# Altium project HighBoard.PrjPcb
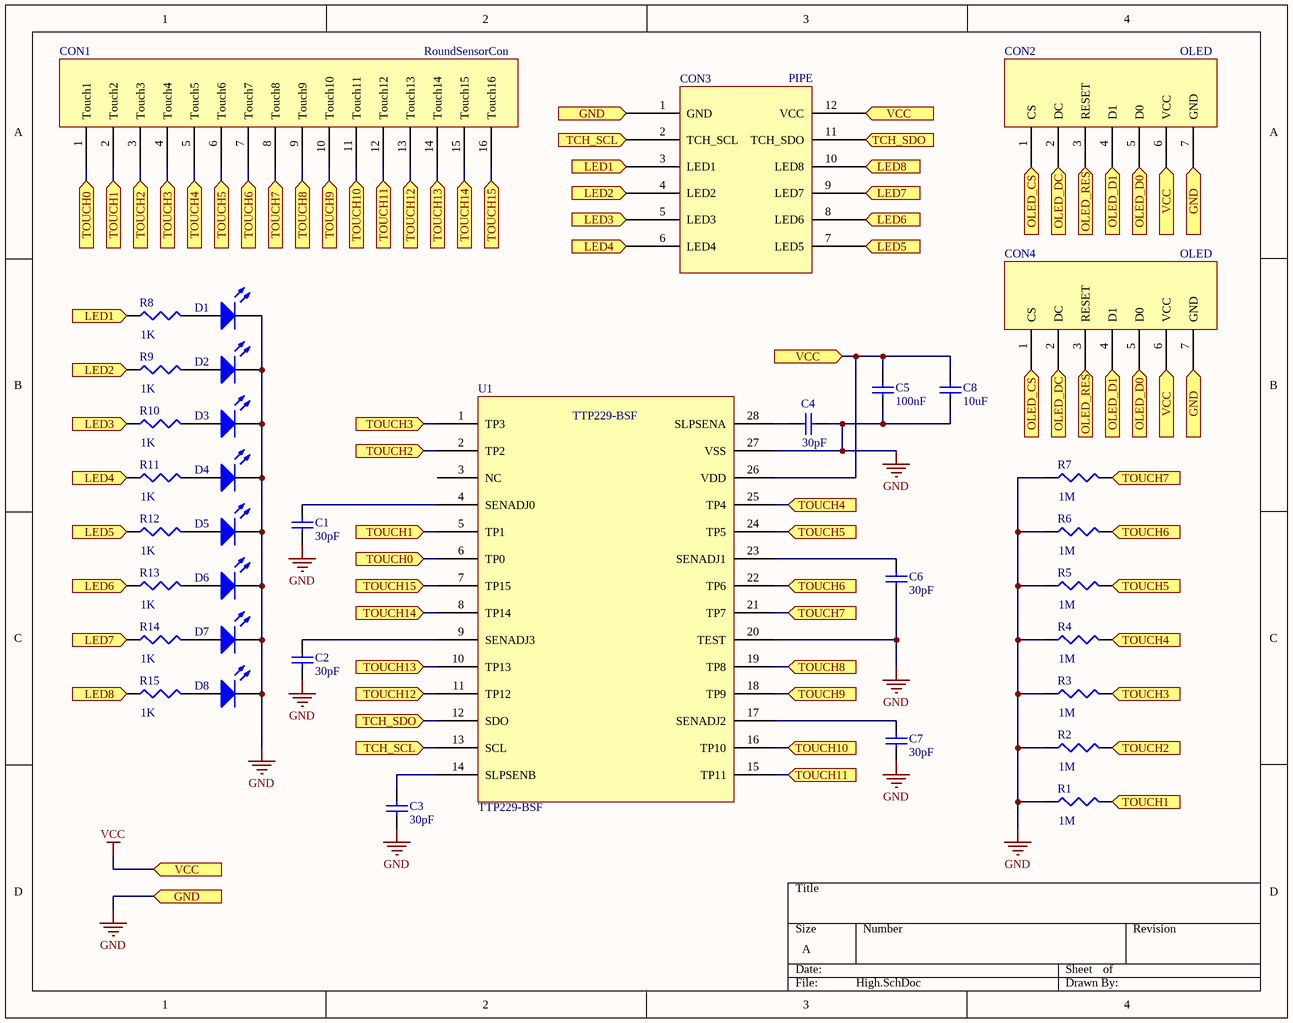
[diagram p0: High.SchDoc]
1 sheet, 36 parts. Net scope: flat (ports and power ports of the same name join across sheets).
Board file: High_v4.PcbDoc

## Sheet High.SchDoc
size A; PageSetup: Record=PageOptions|CenterHorizontal=True|CenterVertical=True|PrintScale=1.00|XCorrection=1.00|YCorrection=1.00|PrintKind=1|BorderSize=5000000|LeftOffset=0|BottomOffset=0|Orientation=2|PaperLength=1000|PaperWidth=1000|Scale=100|PaperSource=7|PrintQuality=-3|MediaType=1|DitherType=10|PrintScaleMode=1|PaperKind=A3|PaperIndex=8

### Parts
C1  value 30pF  [1608[0603]]  (hidden comment: Cap Semi)
C2  value 30pF  [1608[0603]]  (hidden comment: Cap Semi)
C3  value 30pF  [1608[0603]]  (hidden comment: Cap Semi)
C4  value 30pF  [1608[0603]]  (hidden comment: Cap Semi)
C5  value 100nF  [1608[0603]]  (hidden comment: Cap Semi)
C6  value 30pF  [1608[0603]]  (hidden comment: Cap Semi)
C7  value 30pF  [1608[0603]]  (hidden comment: Cap Semi)
C8  value 10uF  [1608[0603]]  (hidden comment: Cap Semi)
CON1  RoundSensorCon  [RoundSensorCon]
CON2  OLED  [OLED]
CON3  PIPE  [PIPE_SMALL]
CON4  OLED  [OLED_SNMALL]
D1  LED2  [LED0603]  (value not drawn)
D2  LED2  [LED0603]  (value not drawn)
D3  LED2  [LED0603]  (value not drawn)
D4  LED2  [LED0603]  (value not drawn)
D5  LED2  [LED0603]  (value not drawn)
D6  LED2  [LED0603]  (value not drawn)
D7  LED2  [LED0603]  (value not drawn)
D8  LED2  [LED0603]  (value not drawn)
R1  value 1M  [J1-0603]  (hidden comment: Res3)
R2  value 1M  [J1-0603]  (hidden comment: Res3)
R3  value 1M  [J1-0603]  (hidden comment: Res3)
R4  value 1M  [J1-0603]  (hidden comment: Res3)
R5  value 1M  [J1-0603]  (hidden comment: Res3)
R6  value 1M  [J1-0603]  (hidden comment: Res3)
R7  value 1M  [J1-0603]  (hidden comment: Res3)
R8  value 1K  [J1-0603]  (hidden comment: Res3)
R9  value 1K  [J1-0603]  (hidden comment: Res3)
R10  value 1K  [J1-0603]  (hidden comment: Res3)
R11  value 1K  [J1-0603]  (hidden comment: Res3)
R12  value 1K  [J1-0603]  (hidden comment: Res3)
R13  value 1K  [J1-0603]  (hidden comment: Res3)
R14  value 1K  [J1-0603]  (hidden comment: Res3)
R15  value 1K  [J1-0603]  (hidden comment: Res3)
U1  TTP229-BSF  [SSOP-28]

### Ports
GND, LED1, LED2, LED3, LED4, LED5, LED6, LED7, LED8, OLED_CS, OLED_D0, OLED_D1, OLED_DC, OLED_RES, TCH_SCL, TCH_SDO, TOUCH0, TOUCH1, TOUCH2, TOUCH3, TOUCH4, TOUCH5, TOUCH6, TOUCH7, TOUCH8, TOUCH9, TOUCH10, TOUCH11, TOUCH12, TOUCH13, TOUCH14, TOUCH15, VCC

### Nets
GND: C1.1 C2.1 C3.1 C4.2 C5.1 C6.1 C7.1 C8.1 CON2.7(GND) CON3.1(GND) CON4.7(GND) D1.2(K) D2.2(K) D3.2(K) D4.2(K) D5.2(K) D6.2(K) D7.2(K) D8.2(K) R1.1 R2.1 R3.1 R4.1 R5.1 R6.1 R7.1 U1.20(TEST) U1.27(VSS) ; port GND
VCC: C5.2 C8.2 CON2.6(VCC) CON3.12(VCC) CON4.6(VCC) U1.26(VDD) ; port VCC
NetC1_2: C1.2 U1.4(SENADJ0)
NetC2_2: C2.2 U1.9(SENADJ3)
NetC3_2: C3.2 U1.14(SLPSENB)
NetC4_1: C4.1 U1.28(SLPSENA)
NetC6_2: C6.2 U1.23(SENADJ1)
NetC7_2: C7.2 U1.17(SENADJ2)
NetCON1_1: CON1.1(Touch1) U1.6(TP0) ; port TOUCH0
NetCON1_2: CON1.2(Touch2) R1.2 U1.5(TP1) ; port TOUCH1
NetCON1_3: CON1.3(Touch3) R2.2 U1.2(TP2) ; port TOUCH2
NetCON1_4: CON1.4(Touch4) R3.2 U1.1(TP3) ; port TOUCH3
NetCON1_5: CON1.5(Touch5) R4.2 U1.25(TP4) ; port TOUCH4
NetCON1_6: CON1.6(Touch6) R5.2 U1.24(TP5) ; port TOUCH5
NetCON1_7: CON1.7(Touch7) R6.2 U1.22(TP6) ; port TOUCH6
NetCON1_8: CON1.8(Touch8) R7.2 U1.21(TP7) ; port TOUCH7
NetCON1_9: CON1.9(Touch9) U1.19(TP8) ; port TOUCH8
NetCON1_10: CON1.10(Touch10) U1.18(TP9) ; port TOUCH9
NetCON1_11: CON1.11(Touch11) U1.16(TP10) ; port TOUCH10
NetCON1_12: CON1.12(Touch12) U1.15(TP11) ; port TOUCH11
NetCON1_13: CON1.13(Touch13) U1.11(TP12) ; port TOUCH12
NetCON1_14: CON1.14(Touch14) U1.10(TP13) ; port TOUCH13
NetCON1_15: CON1.15(Touch15) U1.8(TP14) ; port TOUCH14
NetCON1_16: CON1.16(Touch16) U1.7(TP15) ; port TOUCH15
NetCON2_1: CON2.1(CS) CON4.1(CS) ; port OLED_CS
NetCON2_2: CON2.2(DC) CON4.2(DC) ; port OLED_DC
NetCON2_3: CON2.3(RESET) CON4.3(RESET) ; port OLED_RES
NetCON2_4: CON2.4(D1) CON4.4(D1) ; port OLED_D1
NetCON2_5: CON2.5(D0) CON4.5(D0) ; port OLED_D0
NetCON3_2: CON3.2(TCH_SCL) U1.13(SCL) ; port TCH_SCL
NetCON3_3: CON3.3(LED1) R8.1 ; port LED1
NetCON3_4: CON3.4(LED2) R9.1 ; port LED2
NetCON3_5: CON3.5(LED3) R10.1 ; port LED3
NetCON3_6: CON3.6(LED4) R11.1 ; port LED4
NetCON3_7: CON3.7(LED5) R12.1 ; port LED5
NetCON3_8: CON3.8(LED6) R13.1 ; port LED6
NetCON3_9: CON3.9(LED7) R14.1 ; port LED7
NetCON3_10: CON3.10(LED8) R15.1 ; port LED8
NetCON3_11: CON3.11(TCH_SDO) U1.12(SDO) ; port TCH_SDO
NetD1_1: D1.1(A) R8.2
NetD2_1: D2.1(A) R9.2
NetD3_1: D3.1(A) R10.2
NetD4_1: D4.1(A) R11.2
NetD5_1: D5.1(A) R12.2
NetD6_1: D6.1(A) R13.2
NetD7_1: D7.1(A) R14.2
NetD8_1: D8.1(A) R15.2

Not connected (* = marked no-connect by the designer): U1 3(NC)

### Library data of the parts
C1-C8 = Cap Semi: Capacitor (Semiconductor SIM Model); Published: 8-Jun-2000; LatestRevisionDate: 29-May-2009; LatestRevisionNote: IPC-7351 Footprint Added.; PackageReference: C1206; Publisher: Altium Limited; PackageDescription: Chip Capacitor
D1-D8 = LED2: Typical RED, GREEN, YELLOW, AMBER GaAs LED; Published: 8-Jun-2000; LatestRevisionDate: 17-Jul-2002; LatestRevisionNote: Re-released for DXP Platform.; PackageVersion: Feb-2002; PackageReference: 3.2X1.6X1.1; Publisher: Altium Limited; PackageDescription: SM LED; 2 Flat Leads
R1-R15 = Res3: Resistor; Published: 8-Jun-2000; LatestRevisionDate: 29-May-2009; LatestRevisionNote: IPC-7351 Footprint Added.; PackageReference: J1-0603; Publisher: Altium Limited; PackageDescription: Chip Resistor